# Altium schematic sheet VCO.SchDoc (part 1 of 3)
size Letter; DrawnBy: Titan Yuan; SheetNumber: 1; SheetTotal: 8
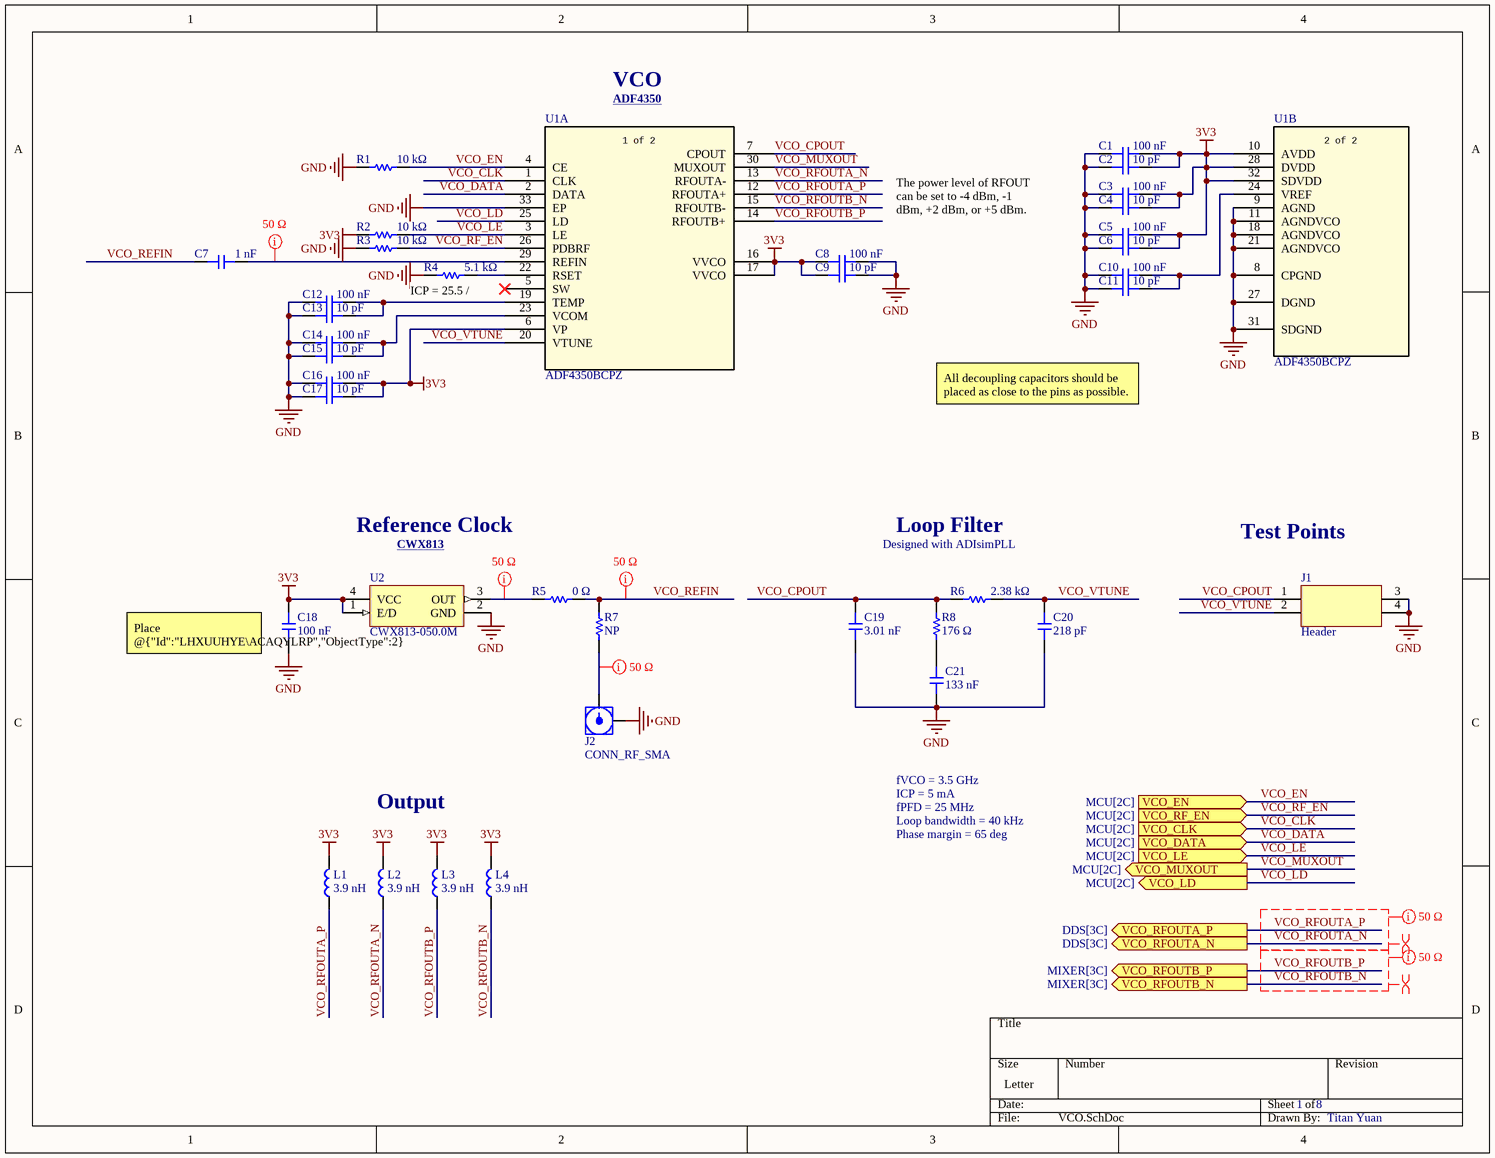
[diagram p0: VCO.SchDoc]

## Parts
C1  100 nF  [CAP_0402]
C2  10 pF  [CAP_0402]
C3  100 nF  [CAP_0402]
C4  10 pF  [CAP_0402]
C5  100 nF  [CAP_0402]
C6  10 pF  [CAP_0402]
C7  1 nF  [CAP_0402]
C8  100 nF  [CAP_0402]
C9  10 pF  [CAP_0402]
C10  100 nF  [CAP_0402]
C11  10 pF  [CAP_0402]
C12  100 nF  [CAP_0402]
C13  10 pF  [CAP_0402]
C14  100 nF  [CAP_0402]
C15  10 pF  [CAP_0402]
C16  100 nF  [CAP_0402]
C17  10 pF  [CAP_0402]
C18  100 nF  [CAP_0402]
C19  3.01 nF  [CAP_0603]
C20  218 pF  [CAP_0603]
C21  133 nF  [CAP_0603]
J1  Header  [CONN_2x2_2.54mm_PinHeader_Vertical]
J2  CONN_RF_SMA  [142-0701-801]
L1  3.9 nH  [IND_0402]
L2  3.9 nH  [IND_0402]
L3  3.9 nH  [IND_0402]
L4  3.9 nH  [IND_0402]
R1  10 kΩ  [RES_0402]
R2  10 kΩ  [RES_0402]
R3  10 kΩ  [RES_0402]
R4  5.1 kΩ  [RES_0402]
R5  0 Ω  [RES_0402]
R6  2.38 kΩ  [RES_0603]
R7  NP  [RES_0402]
R8  176 Ω  [RES_0603]
U1  ADF4350BCPZ  [CP_32_2_ADI]  (parts A,B of 2)
U2  CWX813-050.0M  [CWX8XX]

## Ports
VCO_CLK (in, see MCU[2C]), VCO_DATA (in, see MCU[2C]), VCO_EN (in, see MCU[2C]), VCO_LD (out, see MCU[2C]), VCO_LE (in, see MCU[2C]), VCO_MUXOUT (out, see MCU[2C]), VCO_RF_EN (in, see MCU[2C]), VCO_RFOUTA_N (out, see DDS[3C]), VCO_RFOUTA_P (out, see DDS[3C]), VCO_RFOUTB_N (out, see MIXER[3C]), VCO_RFOUTB_P (out, see MIXER[3C])

## Nets
3V3: C1.2 C2.2 C3.2 C4.2 C5.2 C6.2 C8.1 C9.1 C16.2 C17.2 C18.2 L1.2 L2.2 L3.2 L4.2 R2.1 U1.6(VP) U1.10(AVDD) U1.16(VVCO) U1.17(VVCO) U1.28(DVDD) U1.32(SDVDD) U2.1(E/D) U2.4(VCC)
GND: C1.1 C2.1 C3.1 C4.1 C5.1 C6.1 C8.2 C9.2 C10.1 C11.1 C12.1 C13.1 C14.1 C15.1 C16.1 C17.1 C18.1 C19.1 C20.2 C21.1 J1.3 J1.4 J2.2 R1.1 R3.1 R4.2 U1.8(CPGND) U1.9(AGND) U1.11(AGNDVCO) U1.18(AGNDVCO) U1.21(AGNDVCO) U1.27(DGND) U1.31(SDGND) U1.33(EP) U2.2(GND)
VCO_CLK: U1.1(CLK) ; port VCO_CLK
VCO_CPOUT: C19.2 J1.1 R6.1 R8.2 U1.7(CPOUT)
VCO_DATA: U1.2(DATA) ; port VCO_DATA
VCO_EN: R1.2 U1.4(CE) ; port VCO_EN
VCO_LD: U1.25(LD) ; port VCO_LD
VCO_LE: R2.2 U1.3(LE) ; port VCO_LE
VCO_MUXOUT: U1.30(MUXOUT) ; port VCO_MUXOUT
VCO_REFIN: C7.2 R5.2 R7.2
VCO_RF_EN: R3.2 U1.26(PDBRF) ; port VCO_RF_EN
VCO_RFOUTA_N: L2.1 U1.13(RFOUTA-) ; port VCO_RFOUTA_N
VCO_RFOUTA_P: L1.1 U1.12(RFOUTA+) ; port VCO_RFOUTA_P
VCO_RFOUTB_N: L4.1 U1.15(RFOUTB-) ; port VCO_RFOUTB_N
VCO_RFOUTB_P: L3.1 U1.14(RFOUTB+) ; port VCO_RFOUTB_P
VCO_VTUNE: C20.1 J1.2 R6.2 U1.20(VTUNE)
NetC7_1: C7.1 U1.29(REFIN)
NetC10_2: C10.2 C11.2 U1.24(VREF)
NetC12_2: C12.2 C13.2 U1.19(TEMP)
NetC14_2: C14.2 C15.2 U1.23(VCOM)
NetC21_2: C21.2 R8.1
NetJ2_1: J2.1 R7.1
NetR4_1: R4.1 U1.22(RSET)
NetR5_1: R5.1 U2.3(OUT)

Not connected (* = marked no-connect by the designer): U1 5(SW)*

## Layout directives
net class 50 Ω: NetC7_1, NetJ2_1, NetR5_1, VCO_REFIN, VCO_RFOUTA_N, VCO_RFOUTA_P, VCO_RFOUTB_N, VCO_RFOUTB_P
differential pair: VCO_RFOUTA_N, VCO_RFOUTA_P, VCO_RFOUTB_N, VCO_RFOUTB_P

## Notes on the sheet
- VCO
- (near U1) ADF4350 <https://www.analog.com/en/products/adf4350.html>
- The power level of RFOUT can be set to -4 dBm, -1 dBm, +2 dBm, or +5 dBm.
- (near R4) ICP = 25.5 / @{"Id":"LHXUUHYE\MZKYAKED","ObjectType":2}
- All decoupling capacitors should be placed as close to the pins as possible.
- Reference Clock
- (near U2) CWX813 <https://www.conwin.com/datasheets/sm/sm111.pdf>
- Designed with ADIsimPLL
- Loop Filter
- Test Points
- (near C18) Place @{"Id":"LHXUUHYE\ACAQYLRP","ObjectType":2} right next to pin 2 of @{"Id":"LHXUUHYE\HLDYGQRQ","ObjectType":2}.
- Output
- fPFD = 25 MHz
- Loop bandwidth = 40 kHz
- Phase margin = 65 deg
- fVCO = 3.5 GHz
- ICP = 5 mA
- (in symbol ADF4350BCPZ, part A) 1 of 2
- (in symbol ADF4350BCPZ, part B) 2 of 2